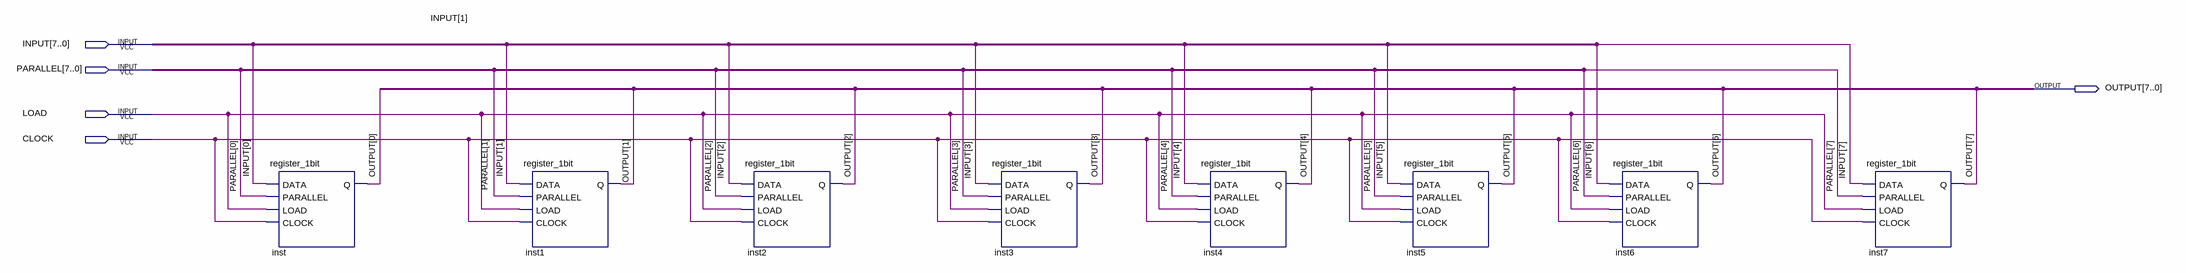
[diagram p0: schematic sheet]
// Quartus schematic register_8bit.bdf as structural Verilog: 8 symbols, 5 pins
module register_8bit (
  input  [7:0] INPUT,
  input  [7:0] PARALLEL,
  input  LOAD,
  input  CLOCK,
  output [7:0] OUTPUT
);

  register_1bit inst (.DATA(INPUT[0]), .PARALLEL(PARALLEL[0]), .LOAD(LOAD), .CLOCK(CLOCK), .Q(OUTPUT[0]));
  register_1bit inst1 (.DATA(INPUT[1]), .PARALLEL(PARALLEL[1]), .LOAD(LOAD), .CLOCK(CLOCK), .Q(OUTPUT[1]));
  register_1bit inst2 (.DATA(INPUT[2]), .PARALLEL(PARALLEL[2]), .LOAD(LOAD), .CLOCK(CLOCK), .Q(OUTPUT[2]));
  register_1bit inst3 (.DATA(INPUT[3]), .PARALLEL(PARALLEL[3]), .LOAD(LOAD), .CLOCK(CLOCK), .Q(OUTPUT[3]));
  register_1bit inst4 (.DATA(INPUT[4]), .PARALLEL(PARALLEL[4]), .LOAD(LOAD), .CLOCK(CLOCK), .Q(OUTPUT[4]));
  register_1bit inst5 (.DATA(INPUT[5]), .PARALLEL(PARALLEL[5]), .LOAD(LOAD), .CLOCK(CLOCK), .Q(OUTPUT[5]));
  register_1bit inst6 (.DATA(INPUT[6]), .PARALLEL(PARALLEL[6]), .LOAD(LOAD), .CLOCK(CLOCK), .Q(OUTPUT[6]));
  register_1bit inst7 (.DATA(INPUT[7]), .PARALLEL(PARALLEL[7]), .LOAD(LOAD), .CLOCK(CLOCK), .Q(OUTPUT[7]));
endmodule
